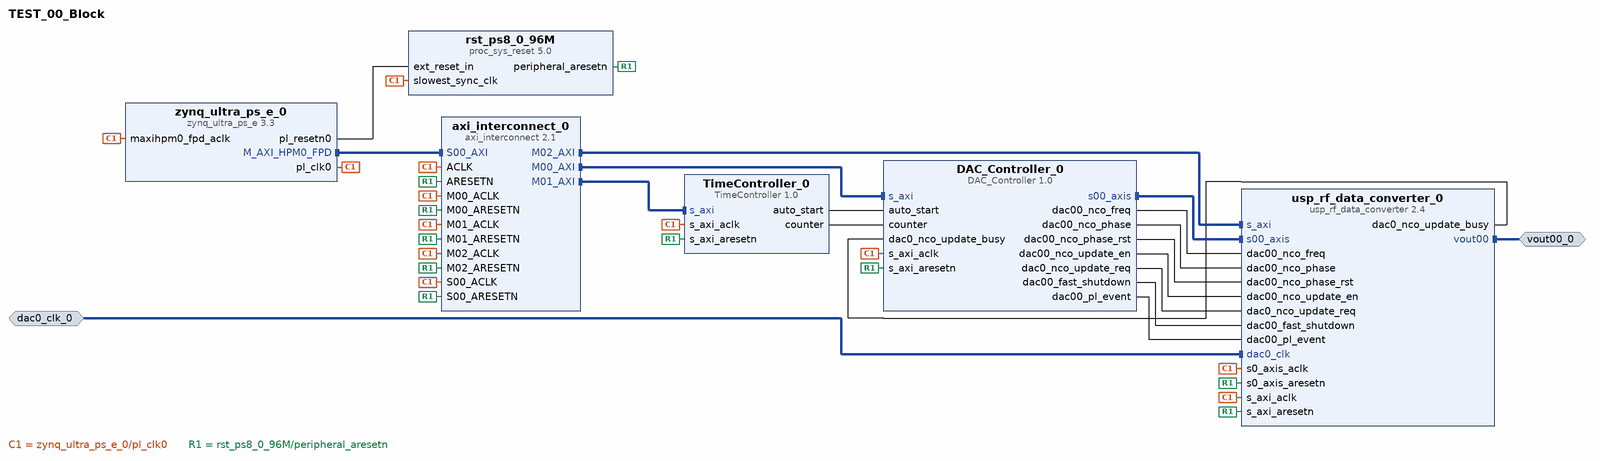
[diagram p0: block diagram of the top level]
# Vivado block design TEST_00_Block, xczu28dr-ffvg1517-2-e, Vivado 2020.2
create_bd_design TEST_00_Block

create_bd_intf_port -mode Slave -vlnv xilinx.com:interface:diff_clock_rtl:1.0 dac0_clk_0
set_property -dict {CONFIG.FREQ_HZ 1600000000} [get_bd_intf_ports dac0_clk_0]
create_bd_intf_port -mode Master -vlnv xilinx.com:interface:diff_analog_io_rtl:1.0 vout00_0

create_bd_cell -type ip -vlnv xilinx.com:ip:zynq_ultra_ps_e:3.3 zynq_ultra_ps_e_0
set_property -dict [list \
  CONFIG.PSU__DDR_HIGH_ADDRESS_GUI_ENABLE 0 \
  CONFIG.PSU__MAXIGP0__DATA_WIDTH 128 \
  CONFIG.PSU__USE__M_AXI_GP0 1 \
  CONFIG.PSU__USE__M_AXI_GP2 0 \
] [get_bd_cells zynq_ultra_ps_e_0]
# 2 more settings of zynq_ultra_ps_e_0 are not shown: defaults, MIO pin electricals, DDR timing, and values the tool derives
create_bd_cell -type ip -vlnv xilinx.com:ip:axi_interconnect:2.1 axi_interconnect_0
set_property -dict {CONFIG.NUM_MI 3} [get_bd_cells axi_interconnect_0]
create_bd_cell -type ip -vlnv xilinx.com:user:DAC_Controller:1.0 DAC_Controller_0
create_bd_cell -type ip -vlnv xilinx.com:user:TimeController:1.0 TimeController_0
create_bd_cell -type ip -vlnv xilinx.com:ip:usp_rf_data_converter:2.4 usp_rf_data_converter_0
set_property -dict [list \
  CONFIG.ADC_Mixer_Type01 3 \
  CONFIG.ADC_Slice00_Enable false \
  CONFIG.DAC0_Refclk_Freq 1600.000 \
  CONFIG.DAC0_Sampling_Rate 1.6 \
  CONFIG.DAC_Data_Type00 0 \
  CONFIG.DAC_Interpolation_Mode00 8 \
  CONFIG.DAC_Mixer_Mode00 0 \
  CONFIG.DAC_Mixer_Type00 2 \
  CONFIG.DAC_NCO_RTS true \
  CONFIG.DAC_Output_Current 1 \
  CONFIG.DAC_RTS true \
  CONFIG.DAC_Slice00_Enable true \
] [get_bd_cells usp_rf_data_converter_0]
create_bd_cell -type ip -vlnv xilinx.com:ip:proc_sys_reset:5.0 rst_ps8_0_96M

# ---- connections ----

connect_bd_intf_net [get_bd_intf_ports vout00_0] [get_bd_intf_pins usp_rf_data_converter_0/vout00]
connect_bd_intf_net [get_bd_intf_pins zynq_ultra_ps_e_0/M_AXI_HPM0_FPD] [get_bd_intf_pins axi_interconnect_0/S00_AXI]
connect_bd_intf_net [get_bd_intf_pins axi_interconnect_0/M00_AXI] [get_bd_intf_pins DAC_Controller_0/s_axi]
connect_bd_intf_net [get_bd_intf_pins axi_interconnect_0/M02_AXI] [get_bd_intf_pins usp_rf_data_converter_0/s_axi]
connect_bd_intf_net [get_bd_intf_pins axi_interconnect_0/M01_AXI] [get_bd_intf_pins TimeController_0/s_axi]
connect_bd_intf_net [get_bd_intf_pins DAC_Controller_0/s00_axis] [get_bd_intf_pins usp_rf_data_converter_0/s00_axis]
connect_bd_intf_net -intf_net dac0_clk_0_1 [get_bd_intf_ports dac0_clk_0] [get_bd_intf_pins usp_rf_data_converter_0/dac0_clk]
connect_bd_net [get_bd_pins DAC_Controller_0/dac00_nco_freq] [get_bd_pins usp_rf_data_converter_0/dac00_nco_freq]
connect_bd_net [get_bd_pins DAC_Controller_0/dac00_nco_phase] [get_bd_pins usp_rf_data_converter_0/dac00_nco_phase]
connect_bd_net [get_bd_pins DAC_Controller_0/dac00_nco_phase_rst] [get_bd_pins usp_rf_data_converter_0/dac00_nco_phase_rst]
connect_bd_net [get_bd_pins DAC_Controller_0/dac00_nco_update_en] [get_bd_pins usp_rf_data_converter_0/dac00_nco_update_en]
connect_bd_net [get_bd_pins DAC_Controller_0/dac0_nco_update_req] [get_bd_pins usp_rf_data_converter_0/dac0_nco_update_req]
connect_bd_net [get_bd_pins usp_rf_data_converter_0/dac0_nco_update_busy] [get_bd_pins DAC_Controller_0/dac0_nco_update_busy]
connect_bd_net [get_bd_pins TimeController_0/auto_start] [get_bd_pins DAC_Controller_0/auto_start]
connect_bd_net [get_bd_pins TimeController_0/counter] [get_bd_pins DAC_Controller_0/counter]
connect_bd_net [get_bd_pins DAC_Controller_0/dac00_fast_shutdown] [get_bd_pins usp_rf_data_converter_0/dac00_fast_shutdown]
connect_bd_net [get_bd_pins DAC_Controller_0/dac00_pl_event] [get_bd_pins usp_rf_data_converter_0/dac00_pl_event]
connect_bd_net [get_bd_pins zynq_ultra_ps_e_0/pl_clk0] \
  [get_bd_pins zynq_ultra_ps_e_0/maxihpm0_fpd_aclk] [get_bd_pins axi_interconnect_0/ACLK] \
  [get_bd_pins rst_ps8_0_96M/slowest_sync_clk] [get_bd_pins axi_interconnect_0/M00_ACLK] \
  [get_bd_pins DAC_Controller_0/s_axi_aclk] [get_bd_pins TimeController_0/s_axi_aclk] \
  [get_bd_pins axi_interconnect_0/M01_ACLK] [get_bd_pins axi_interconnect_0/M02_ACLK] \
  [get_bd_pins usp_rf_data_converter_0/s_axi_aclk] [get_bd_pins axi_interconnect_0/S00_ACLK] \
  [get_bd_pins usp_rf_data_converter_0/s0_axis_aclk]
connect_bd_net [get_bd_pins zynq_ultra_ps_e_0/pl_resetn0] [get_bd_pins rst_ps8_0_96M/ext_reset_in]
connect_bd_net [get_bd_pins rst_ps8_0_96M/peripheral_aresetn] \
  [get_bd_pins axi_interconnect_0/ARESETN] [get_bd_pins axi_interconnect_0/M00_ARESETN] \
  [get_bd_pins DAC_Controller_0/s_axi_aresetn] [get_bd_pins TimeController_0/s_axi_aresetn] \
  [get_bd_pins axi_interconnect_0/M01_ARESETN] [get_bd_pins axi_interconnect_0/M02_ARESETN] \
  [get_bd_pins usp_rf_data_converter_0/s_axi_aresetn] [get_bd_pins axi_interconnect_0/S00_ARESETN] \
  [get_bd_pins usp_rf_data_converter_0/s0_axis_aresetn]

# ---- address map ----
assign_bd_address -offset 0x00A0000000 -range 4K -target_address_space [get_bd_addr_spaces zynq_ultra_ps_e_0/Data] [get_bd_addr_segs DAC_Controller_0/s_axi/reg0]
assign_bd_address -offset 0x00A0010000 -range 4K -target_address_space [get_bd_addr_spaces zynq_ultra_ps_e_0/Data] [get_bd_addr_segs TimeController_0/s_axi/reg0]
assign_bd_address -offset 0x00A0040000 -range 256K -target_address_space [get_bd_addr_spaces zynq_ultra_ps_e_0/Data] [get_bd_addr_segs usp_rf_data_converter_0/s_axi/Reg]

validate_bd_design
save_bd_design
